# Altium schematic sheet Hoja_Rectificador.SchDoc
size A4
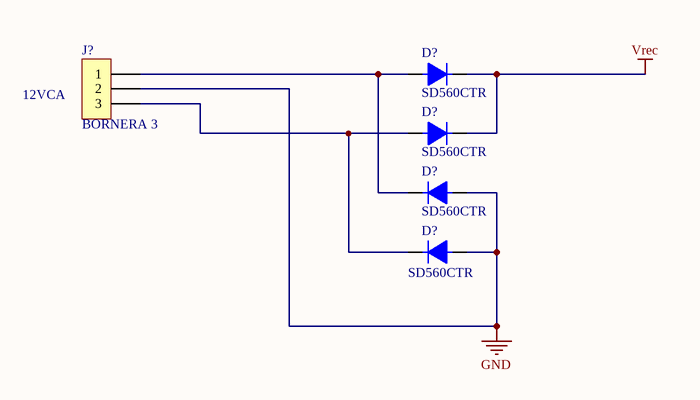
[diagram p0: Hoja_Rectificador.SchDoc]

## Parts
(Parts that share a designator on the sheet are numbered #1, #2 ... from top to bottom, then left to right.)
D?#1  SD560CTR  [SMC+B]
D?#2  SD560CTR  [SMC+B]
D?#3  SD560CTR  [SMC+B]
D?#4  SD560CTR  [SMC+B]
J?  BORNERA 3  [BORNERA3_DegsonH]

## Nets
GND: D?#3.1 D?#4.1 J?.2
Vrec: D?#1.2 D?#2.2
NetD?#1_1: D?#1.1 D?#3.2 J?.1
NetD?#2_1: D?#2.1 D?#4.2 J?.3

## Notes on the sheet
- (near J?) 12VCA

## Library data of the parts
D?#1-D?#4 = DIODO